# EAGLE design dual opamp proto board (EAGLE 7.2.0)
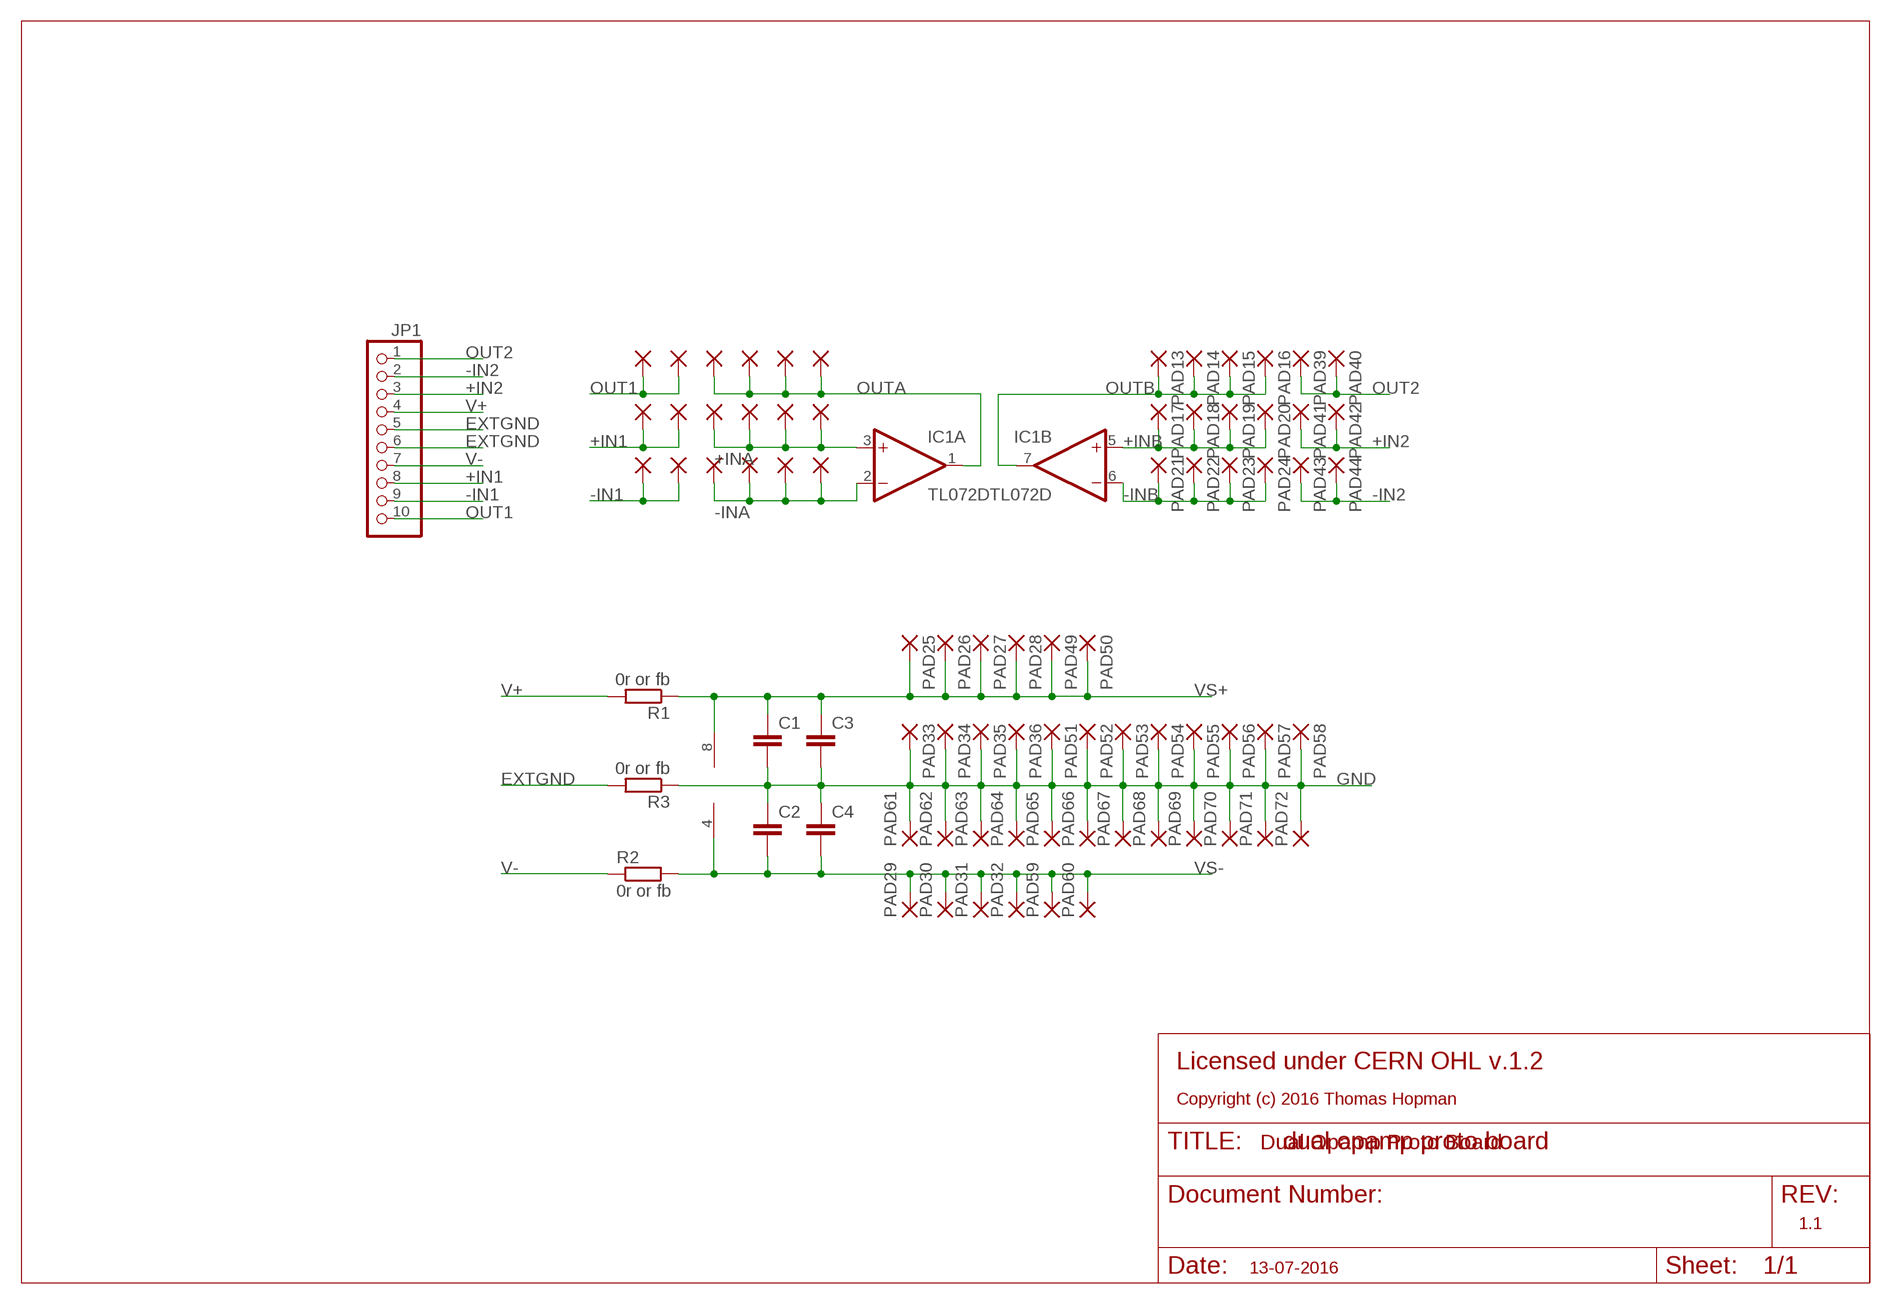
[diagram p0: schematic, sheet 1]

## Parts
C1  C-EUC0805  [C0805]
C2  C-EUC0805  [C0805]
C3  C-EUC1206  [C1206]
C4  C-EUC1206  [C1206]
IC1  TL072D  [SO08]
JP1  PINHD-1X10  [1X10]
PAD1  2,15/1,0  [2,15/1,0]
PAD2  2,15/1,0  [2,15/1,0]
PAD3  2,15/1,0  [2,15/1,0]
PAD4  2,15/1,0  [2,15/1,0]
PAD5  2,15/1,0  [2,15/1,0]
PAD6  2,15/1,0  [2,15/1,0]
PAD7  2,15/1,0  [2,15/1,0]
PAD8  2,15/1,0  [2,15/1,0]
PAD9  2,15/1,0  [2,15/1,0]
PAD10  2,15/1,0  [2,15/1,0]
PAD11  2,15/1,0  [2,15/1,0]
PAD12  2,15/1,0  [2,15/1,0]
PAD13  2,15/1,0  [2,15/1,0]
PAD14  2,15/1,0  [2,15/1,0]
PAD15  2,15/1,0  [2,15/1,0]
PAD16  2,15/1,0  [2,15/1,0]
PAD17  2,15/1,0  [2,15/1,0]
PAD18  2,15/1,0  [2,15/1,0]
PAD19  2,15/1,0  [2,15/1,0]
PAD20  2,15/1,0  [2,15/1,0]
PAD21  2,15/1,0  [2,15/1,0]
PAD22  2,15/1,0  [2,15/1,0]
PAD23  2,15/1,0  [2,15/1,0]
PAD24  2,15/1,0  [2,15/1,0]
PAD25  2,15/1,0  [2,15/1,0]
PAD26  2,15/1,0  [2,15/1,0]
PAD27  2,15/1,0  [2,15/1,0]
PAD28  2,15/1,0  [2,15/1,0]
PAD29  2,15/1,0  [2,15/1,0]
PAD30  2,15/1,0  [2,15/1,0]
PAD31  2,15/1,0  [2,15/1,0]
PAD32  2,15/1,0  [2,15/1,0]
PAD33  2,15/1,0  [2,15/1,0]
PAD34  2,15/1,0  [2,15/1,0]
PAD35  2,15/1,0  [2,15/1,0]
PAD36  2,15/1,0  [2,15/1,0]
PAD37  2,15/1,0  [2,15/1,0]
PAD38  2,15/1,0  [2,15/1,0]
PAD39  2,15/1,0  [2,15/1,0]
PAD40  2,15/1,0  [2,15/1,0]
PAD41  2,15/1,0  [2,15/1,0]
PAD42  2,15/1,0  [2,15/1,0]
PAD43  2,15/1,0  [2,15/1,0]
PAD44  2,15/1,0  [2,15/1,0]
PAD45  2,15/1,0  [2,15/1,0]
PAD46  2,15/1,0  [2,15/1,0]
PAD47  2,15/1,0  [2,15/1,0]
PAD48  2,15/1,0  [2,15/1,0]
PAD49  2,15/1,0  [2,15/1,0]
PAD50  2,15/1,0  [2,15/1,0]
PAD51  2,15/1,0  [2,15/1,0]
PAD52  2,15/1,0  [2,15/1,0]
PAD53  2,15/1,0  [2,15/1,0]
PAD54  2,15/1,0  [2,15/1,0]
PAD55  2,15/1,0  [2,15/1,0]
PAD56  2,15/1,0  [2,15/1,0]
PAD57  2,15/1,0  [2,15/1,0]
PAD58  2,15/1,0  [2,15/1,0]
PAD59  2,15/1,0  [2,15/1,0]
PAD60  2,15/1,0  [2,15/1,0]
PAD61  2,15/1,0  [2,15/1,0]
PAD62  2,15/1,0  [2,15/1,0]
PAD63  2,15/1,0  [2,15/1,0]
PAD64  2,15/1,0  [2,15/1,0]
PAD65  2,15/1,0  [2,15/1,0]
PAD66  2,15/1,0  [2,15/1,0]
PAD67  2,15/1,0  [2,15/1,0]
PAD68  2,15/1,0  [2,15/1,0]
PAD69  2,15/1,0  [2,15/1,0]
PAD70  2,15/1,0  [2,15/1,0]
PAD71  2,15/1,0  [2,15/1,0]
PAD72  2,15/1,0  [2,15/1,0]
R1  0r or fb  R-EU_R0805  [R0805]
R2  0r or fb  R-EU_R0805  [R0805]
R3  0r or fb  R-EU_R0805  [R0805]

## Nets
+IN1: JP1.8 PAD45.1(P) PAD46.1(P)
+IN2: JP1.3 PAD41.1(P) PAD42.1(P)
+INA: IC1.3(A:+IN) PAD5.1(P) PAD6.1(P) PAD7.1(P) PAD8.1(P)
+INB: IC1.5(B:+IN) PAD17.1(P) PAD18.1(P) PAD19.1(P) PAD20.1(P)
-IN1: JP1.9 PAD47.1(P) PAD48.1(P)
-IN2: JP1.2 PAD43.1(P) PAD44.1(P)
-INA: IC1.2(A:-IN) PAD9.1(P) PAD10.1(P) PAD11.1(P) PAD12.1(P)
-INB: IC1.6(B:-IN) PAD21.1(P) PAD22.1(P) PAD23.1(P) PAD24.1(P)
EXTGND: JP1.5 JP1.6 R3.2
GND: C1.2 C2.1 C3.2 C4.1 PAD33.1(P) PAD34.1(P) PAD35.1(P) PAD36.1(P) PAD51.1(P) PAD52.1(P) PAD53.1(P) PAD54.1(P) PAD55.1(P) PAD56.1(P) PAD57.1(P) PAD58.1(P) PAD61.1(P) PAD62.1(P) PAD63.1(P) PAD64.1(P) PAD65.1(P) PAD66.1(P) PAD67.1(P) PAD68.1(P) PAD69.1(P) PAD70.1(P) PAD71.1(P) PAD72.1(P) R3.1
OUT1: JP1.10 PAD37.1(P) PAD38.1(P)
OUT2: JP1.1 PAD39.1(P) PAD40.1(P)
OUTA: IC1.1(A:OUT) PAD1.1(P) PAD2.1(P) PAD3.1(P) PAD4.1(P)
OUTB: IC1.7(B:OUT) PAD13.1(P) PAD14.1(P) PAD15.1(P) PAD16.1(P)
V+: JP1.4 R1.2
V-: JP1.7 R2.1
VS+: C1.1 C3.1 IC1.8(P:V+) PAD25.1(P) PAD26.1(P) PAD27.1(P) PAD28.1(P) PAD49.1(P) PAD50.1(P) R1.1
VS-: C2.2 C4.2 IC1.4(P:V-) PAD29.1(P) PAD30.1(P) PAD31.1(P) PAD32.1(P) PAD59.1(P) PAD60.1(P) R2.2

## Notes on the sheet
- Licensed under CERN OHL v.1.2
- Copyright (c) 2016 Thomas Hopman
- Dual Opamp Proto Board
- 1.1
- 13-07-2016

## Library data of the parts
C1-C4 = resistor:C-EU: CAPACITOR, European symbol
IC1 = linear:TL072: OP AMP
JP1 = pinhead:PINHD-1X10: PIN HEADER
PAD1-PAD72 = wirepad:2,15/1,0: THROUGH-HOLE PAD
R1-R3 = resistor:R-EU_: RESISTOR, European symbol

## Board
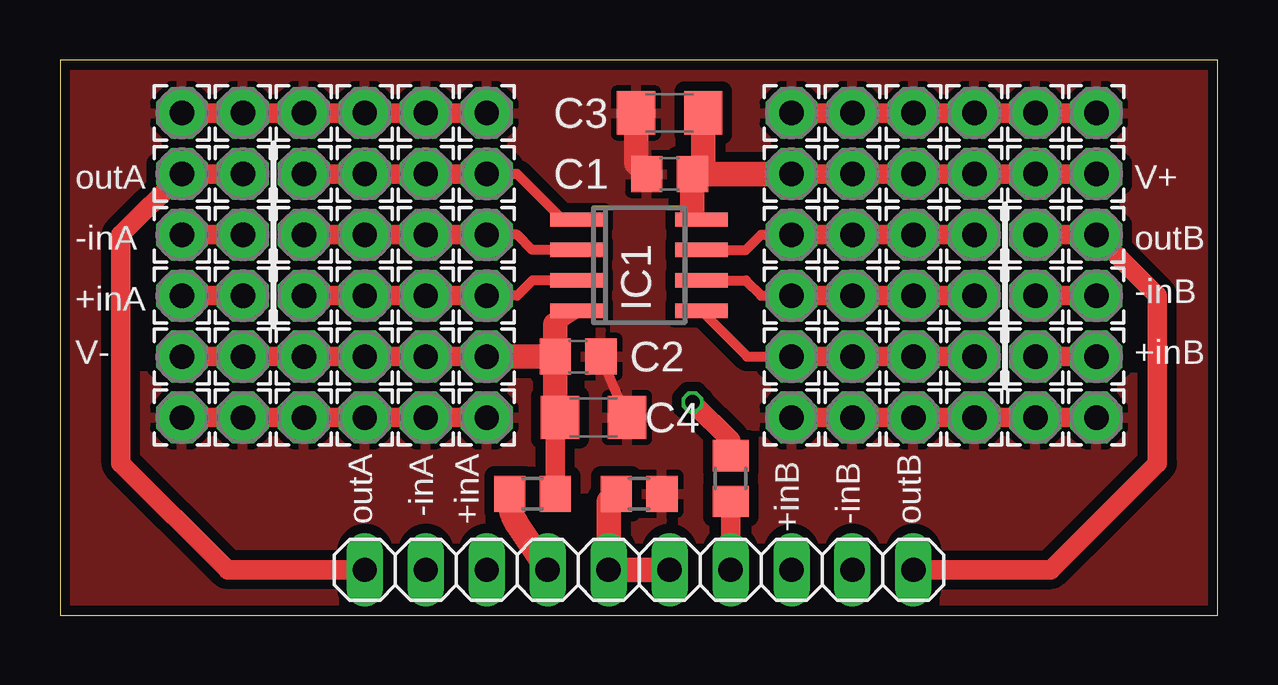
[diagram p1: board, top side]
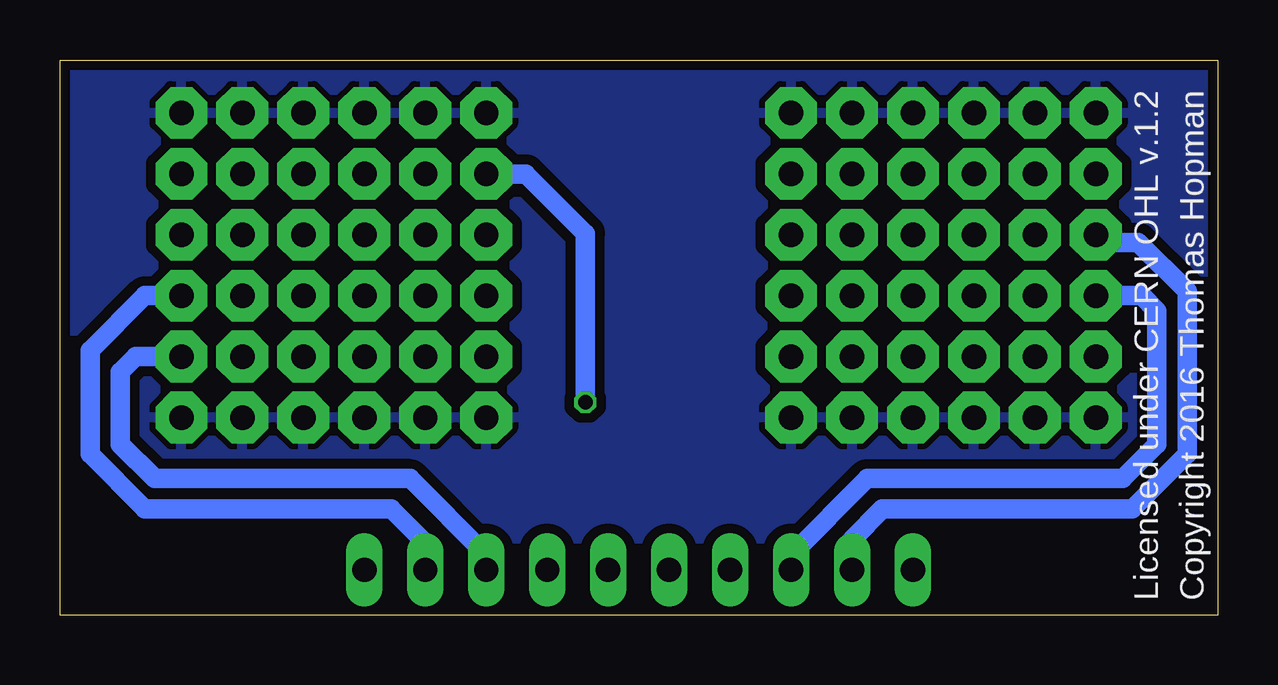
[diagram p2: board, bottom side, seen from below]

Size 48.24 x 23.16 mm. Coordinates in mm from the lower left corner, seen from the top.
Outline: 0,0 48.24,0 48.24,23.16 0,23.16 0,0
Copper layers (1*16): Top 0.035mm / dielectric 1.5mm / Bottom 0.035mm
Design rules "dirt_cheap_dirty_boards.v1": minimum track width 5mil, minimum drill 12mil, track to track 5mil, track to pad 5mil, pad to pad 5mil, via to via 5mil, smd to smd 0mil, copper to edge 10mil, drill to drill 10mil, minimum pad ring 10mil, minimum via ring 6mil, stop-mask expansion 2mil, vias tented up to drill 25mil, thermal gap 10mil

### Footprints (pad centres in the part's own frame; a part is rotated, then mirrored left to right if it is on the bottom)
C0805 = smd 1.3 x 1.5: 1 -0.95,0; 2 0.95,0
C1206 = smd 1.6 x 1.8: 1 -1.4,0; 2 1.4,0
SO08 = smd 0.6 x 2.2: 1 -1.905,-2.6; 2 -0.635,-2.6; 3 0.635,-2.6; 4 1.905,-2.6; 5 1.905,2.6; 6 0.635,2.6; 7 -0.635,2.6; 8 -1.905,2.6
1X10 = drill 1.016 long: 1 -11.43,0; 2 -8.89,0; 3 -6.35,0; 4 -3.81,0; 5 -1.27,0; 6 1.27,0; 7 3.81,0; 8 6.35,0; 9 8.89,0; 10 11.43,0
2,15/1,0 = drill 1.016 pad 2.159 octagon: 1 0,0
R0805 = smd 1.3 x 1.5: 1 -0.95,0; 2 0.95,0

### Placement (x,y rotation side)
C1  25.4,18.41 180 top
C2  21.59,10.79 180 top
C3  25.4,20.95 180 top
C4  22.23,8.26 180 top
IC1  24.13,14.61 270 top
JP1  24.13,1.91 180 top
PAD1  17.78,18.41 180 top
PAD2  15.24,18.41 180 top
PAD3  12.7,18.41 180 top
PAD4  10.16,18.41 180 top
PAD5  12.7,13.34 180 top
PAD6  10.16,13.34 180 top
PAD7  17.78,13.34 180 top
PAD8  15.24,13.34 180 top
PAD9  17.78,15.88 180 top
PAD10  15.24,15.88 180 top
PAD11  12.7,15.88 180 top
PAD12  10.16,15.88 180 top
PAD13  30.48,15.88 180 top
PAD14  33.02,15.88 180 top
PAD15  35.56,15.88 180 top
PAD16  38.1,15.88 180 top
PAD17  38.1,10.79 180 top
PAD18  30.48,10.79 180 top
PAD19  33.02,10.79 180 top
PAD20  35.56,10.79 180 top
PAD21  35.56,13.34 180 top
PAD22  38.1,13.34 180 top
PAD23  30.48,13.34 180 top
PAD24  33.02,13.34 180 top
PAD25  30.48,18.41 180 top
PAD26  33.02,18.41 180 top
PAD27  35.56,18.41 180 top
PAD28  38.1,18.41 180 top
PAD29  17.78,10.79 180 top
PAD30  15.24,10.79 180 top
PAD31  12.7,10.79 180 top
PAD32  10.16,10.79 180 top
PAD33  35.56,8.26 180 top
PAD34  38.1,8.26 180 top
PAD35  12.7,20.95 180 top
PAD36  10.16,20.95 180 top
PAD37  5.08,18.41 270 top
PAD38  7.62,18.41 270 top
PAD39  43.18,15.88 270 top
PAD40  40.64,15.88 270 top
PAD41  40.64,10.79 270 top
PAD42  43.18,10.79 270 top
PAD43  40.64,13.34 270 top
PAD44  43.18,13.34 270 top
PAD45  7.62,13.34 270 top
PAD46  5.08,13.34 270 top
PAD47  7.62,15.88 270 top
PAD48  5.08,15.88 270 top
PAD49  40.64,18.41 270 top
PAD50  43.18,18.41 270 top
PAD51  17.78,20.95 180 top
PAD52  15.24,20.95 180 top
PAD53  7.62,20.95 270 top
PAD54  33.02,8.26 270 top
PAD55  30.48,8.26 270 top
PAD56  40.64,8.26 270 top
PAD57  43.18,8.26 270 top
PAD58  5.08,20.95 270 top
PAD59  7.62,10.79 180 top
PAD60  5.08,10.79 270 top
PAD61  30.48,20.95 180 top
PAD62  33.02,20.95 180 top
PAD63  35.56,20.95 180 top
PAD64  38.1,20.95 180 top
PAD65  40.64,20.95 180 top
PAD66  43.18,20.95 180 top
PAD67  17.78,8.26 180 top
PAD68  15.24,8.26 180 top
PAD69  12.7,8.26 180 top
PAD70  10.16,8.26 180 top
PAD71  7.62,8.26 180 top
PAD72  5.08,8.26 180 top
R1  27.94,5.71 270 top
R2  19.68,5.08 0 top
R3  24.13,5.08 180 top

### Tracks (layer width: path | path; a pad name or v marks a point on that pad's centre or on a via)
+IN1
  Top 0.813: PAD46.1 PAD45.1
  Bottom 0.813: JP1.8 17.78,2.54 14.61,5.71 3.96,5.71 2.54,7.13 2.54,12.7 3.17,13.34 PAD46.1
+IN2
  Top 0.813: PAD41.1 PAD42.1
  Bottom 0.813: JP1.3 30.48,2.54 33.66,5.71 44.3,5.71 45.72,7.13 45.72,10.16 45.09,10.79 PAD42.1
+INA
  Top 0.406: IC1.3 19.68,13.97 19.05,13.34 PAD7.1
  Top 0.813: PAD7.1 PAD8.1 PAD5.1 PAD6.1
+INB
  Top 0.406: IC1.5 28.64,10.79 PAD18.1
  Top 0.813: PAD18.1 PAD19.1 PAD20.1 PAD17.1
-IN1
  Top 0.813: PAD48.1 PAD47.1
  Bottom 0.813: JP1.9 15.24,3.17 13.97,4.45 3.56,4.45 1.27,6.74 1.27,13.53 3.3,15.56 5.08,15.56 PAD48.1
-IN2
  Top 0.813: PAD43.1 PAD44.1
  Bottom 0.813: JP1.2 33.02,3.02 34.44,4.45 44.7,4.45 46.99,6.74 46.99,11.04 44.7,13.34 PAD44.1
-INA
  Top 0.406: IC1.2 19.68,15.24 19.05,15.88 PAD9.1
  Top 0.813: PAD9.1 PAD10.1 PAD11.1 PAD12.1
-INB
  Top 0.406: IC1.6 28.57,13.97 29.21,13.34 PAD23.1
  Top 0.813: PAD23.1 PAD24.1 PAD21.1 PAD22.1
EXTGND
  Top 1.016: JP1.5 JP1.6 22.86,4.76 R3.2
GND
  Top 0.406: C4.1 C2.1
  Top 0.813: PAD72.1 PAD71.1 PAD70.1 PAD69.1 PAD68.1 PAD67.1 | PAD55.1 PAD54.1 PAD33.1 PAD34.1 PAD56.1 PAD57.1 | PAD58.1 PAD53.1 PAD36.1 PAD35.1 PAD52.1 PAD51.1 | PAD61.1 PAD62.1 PAD63.1 PAD64.1 PAD65.1 PAD66.1
  Top 1.016: C3.2 24,18.86 C1.2
  pour Top (isolate 0.406): 0,0 0,22.86 48.26,22.86 48.26,0
  pour Bottom (isolate 0.406): 0,0 0,22.86 48.26,22.86 48.26,0
OUT1
  Top 0.813: PAD38.1 PAD37.1 2.54,15.88 2.54,6.35 6.99,1.91 JP1.10
OUT2
  Top 0.813: PAD40.1 PAD39.1 45.72,13.34 45.72,6.35 41.27,1.91 JP1.1
OUTA
  Top 0.406: IC1.1 20.95,16.51 19.05,18.41 PAD1.1
  Top 0.813: PAD1.1 PAD2.1 PAD3.1 PAD4.1
OUTB
  Top 0.406: IC1.7 28.57,15.24 29.21,15.88 PAD13.1
  Top 0.813: PAD13.1 PAD14.1 PAD15.1 PAD16.1
V+
  Top 0.813: JP1.4 R1.2
V-
  Top 1.016: JP1.7 19.05,3.81 arc-40 R2.1
VS+  (via drill 0.6)
  Top 0.61: 26.35,16.89 IC1.8
  Top 0.813: PAD50.1 PAD49.1 PAD28.1 PAD27.1 PAD26.1 PAD25.1 | R1.1 27.94,7.3 v26.35,8.89 | 26.8,18.86 C1.1
  Top 1.016: PAD25.1 C1.1 26.35,16.89 | C3.1 26.8,18.86
  Bottom 0.813: v26.35,8.89 26.35,15.94 28.83,18.41 PAD25.1
VS-
  Top 0.61: 20.64,12.13 IC1.4
  Top 0.813: PAD29.1 PAD30.1 PAD31.1 PAD32.1 PAD59.1 PAD60.1 | R2.2 20.64,8.26 C4.2 20.64,8.26
  Top 1.016: C2.2 PAD29.1 | C2.2 20.64,12.13 | 20.64,8.26 C2.2

### Text on the board
bPlace: Copyright 2016 Thomas Hopman | Licensed under CERN OHL v.1.2
tSilk: outA | V+ | -inA | outB | +inA | -inB | V- | +inB | outA | -inA | +inA | -inB | outB | +inB